# Altium schematic sheet RTC.SchDoc: Ixora
size A3; Organization: Toradex AG; Address1: Altsagenstrasse 5; Address2: Horw; Address3: 6048; Address4: Switzerland; DocumentNumber: 5; Revision: V1.1; SheetNumber: 7; SheetTotal: 17; PageSetup: Record=PageOptions|CenterHorizontal=True|CenterVertical=True|PrintScale=0.73|XCorrection=1.00|YCorrection=1.00|PrintKind=0|BorderSize=5000000|LeftOffset=0|BottomOffset=0|Orientation=2|PaperLength=1000|PaperWidth=1000|Scale=100|PaperSource=7|PrintQuality=-4|MediaType=1|DitherType=10|PaperKind=A4|PrintScaleMode=1
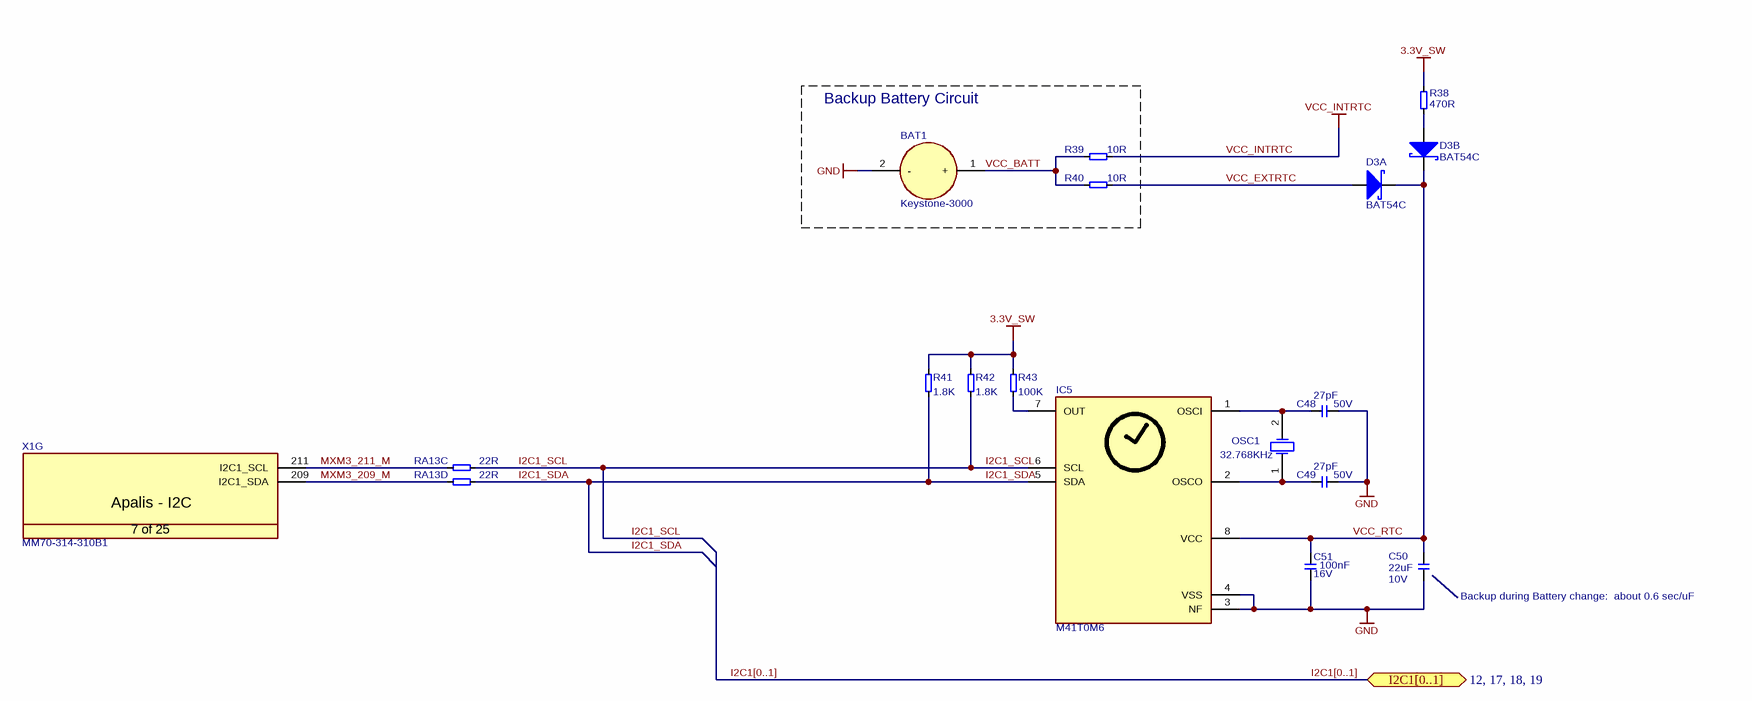
[diagram p0: RTC.SchDoc]

## Parts
BAT1  Keystone-3000  [T_Keystone_3000]
C48  Rating: 50V  [T_CAPC0603X33N]  (hidden comment: 27pF)
C49  Rating: 50V  [T_CAPC0603X33N]  (hidden comment: 27pF)
C50  Rating: 10V  [T_CAPC0805X125N]  (hidden comment: 22uF)
C51  Rating: 16V  [CAPC1005X60N]  (hidden comment: 100nF)
D3  BAT54C  [SOT95P230X110-3N]  (parts A,B of 2)
IC5  M41T0M6  [SOIC127P600X173-8N]
OSC1  value 32.768KHz  [T_MC_CC4V-T1A]  (hidden comment: CC4V-T1A)
R38  470R  [RESC1005X40N]
R39  10R  [T_RESC0603X30N]
R40  10R  [T_RESC0603X30N]
R41  1.8K  [RESC1005X40N]
R42  1.8K  [RESC1005X40N]
R43  100K  [RESC1005X40N]
RA13  22R  [T_Resistor_Array_X4]  (parts C,D of 4)
X1  Manufacturer Part No.: MM70-314-310B1  [T_JAE_MM70-314-310B1]  (hidden comment: CON-JAE-MM70-314-310B1-314-0.5mm)  (part G of 25)

## Blocks framed on the sheet
Backup Battery Circuit: BAT1 R39 R40

## Ports
I2C1[0..1] (bidir, see 12, 17, 18, 19)

## Nets
3.3V_SW: R38.2 R41.2 R42.2 R43.2
GND: BAT1.2(-) C48.2 C49.2 C50.2 C51.1 IC5.3(NF) IC5.4(VSS)
VCC_INTRTC: R39.2
I2C1_SCL: IC5.6(SCL) R42.1 RA13.7
I2C1_SDA: IC5.5(SDA) R41.1 RA13.8
MXM3_209_M: RA13.4 X1.209(I2C1_SDA)
MXM3_211_M: RA13.3 X1.211(I2C1_SCL)
VCC_BATT: BAT1.1(+) R39.1 R40.1
VCC_EXTRTC: D3.1 R40.2
VCC_RTC: C50.1 C51.2 D3.3 IC5.8(VCC)
NetC48_1: C48.1 IC5.1(OSCI) OSC1.2(OSC2)
NetC49_1: C49.1 IC5.2(OSCO) OSC1.1(OSC1)
NetD3_2: D3.2 R38.1
NetIC5_7: IC5.7(OUT) R43.1

## Buses and harness runs
bus I2C1[0..1] = port I2C1[0..1]

## Notes on the sheet
- (near C50) Backup during Battery change:  about 0.6 sec/uF
- Title
- Size:
- Date:
- A3
- Number:
- Time:
- Revision:
- Sheet
- of
- File:
- (in symbol CON-JAE-MM70-314-310B1-314-0.5mm, part G) Apalis - I2C; 7 of 25

## Library data of the parts
BAT1 = BAT-Keystone-3000: Battery Holder; Manufacturer Part No.: 3000; Manufacturer Name: Keystone
C48 C49 = C-NPO-27pF-50V-5%-0603: Capacitor Ceramic NPO 27pF 50V 5% 0603; Tolerance: 5%; Type: NPO; Value: 27pF
C50 = C-X5R-22uF-10V-20%-0805: Capacitor Ceramic X5R 22uF 10V 20% 0805; Tolerance: 20%; Type: X5R; Value: 22uF
C51 = C-X7R-100nF-16V-10%-0402: Capacitor Ceramic X7R 100nF 16V 10% 0402; Tolerance: 10%; Type: X7R; Value: 100nF
D3 = D-Philips-BAT54C-Schottky-30V-200mA: BAT54 Schottky Diode; Manufacturer: Philips; Manufacturer Part Number: BAT54C
IC5 = IC-ST-M41T0M6: RTC M41T0M6; Manufacturer Name: ST; Manufacturer Part No.: M41T0M6
OSC1 = OSC-MC-CC4V-T1A-32.768KHz-30ppm-5x1.9mm: Quartz 32.768kHz; Manufacturer Name: Micro Crystal; Tolerance: 30ppm; Manufacturer Part No.: CC4V-T1A
R38 = R-470R-63mW-5%-0402: Resistor 470 ohm 63mW 5% 0402; Rating: 63mW; Tolerance: 5%; Value: 470R
R39 R40 = R-10R-63mW-5%-0603: Resistor 10 ohm 63mW 5% 0603; Rating: 63mW; Tolerance: 5%; Value: 10R
R41 R42 = R-1.8KR-63mW-5%-0402: Resistor 1.8 Kohm 63mW 5% 0402; Value: 1.8KR; Rating: 63mW; Tolerance: 5%
R43 = R-100KR-63mW-5%-0402: Resistor 100 Kohm 63mW 5% 0402; Value: 100KR; Rating: 63mW; Tolerance: 5%
RA13 = RA-22R-63mW-5%-1206-div: Resistor Array 22 R 63mW 5% 1206; Tolerance: 5%; Power Dissipation: 63mW; Value: 22R
X1 = CON-JAE-MM70-314-310B1-314-0.5mm: MXM3 Connector; Manufacturer Name: JAE; No. of ways: 314